# EAGLE schematic RasPiDV (EAGLE 6.4)
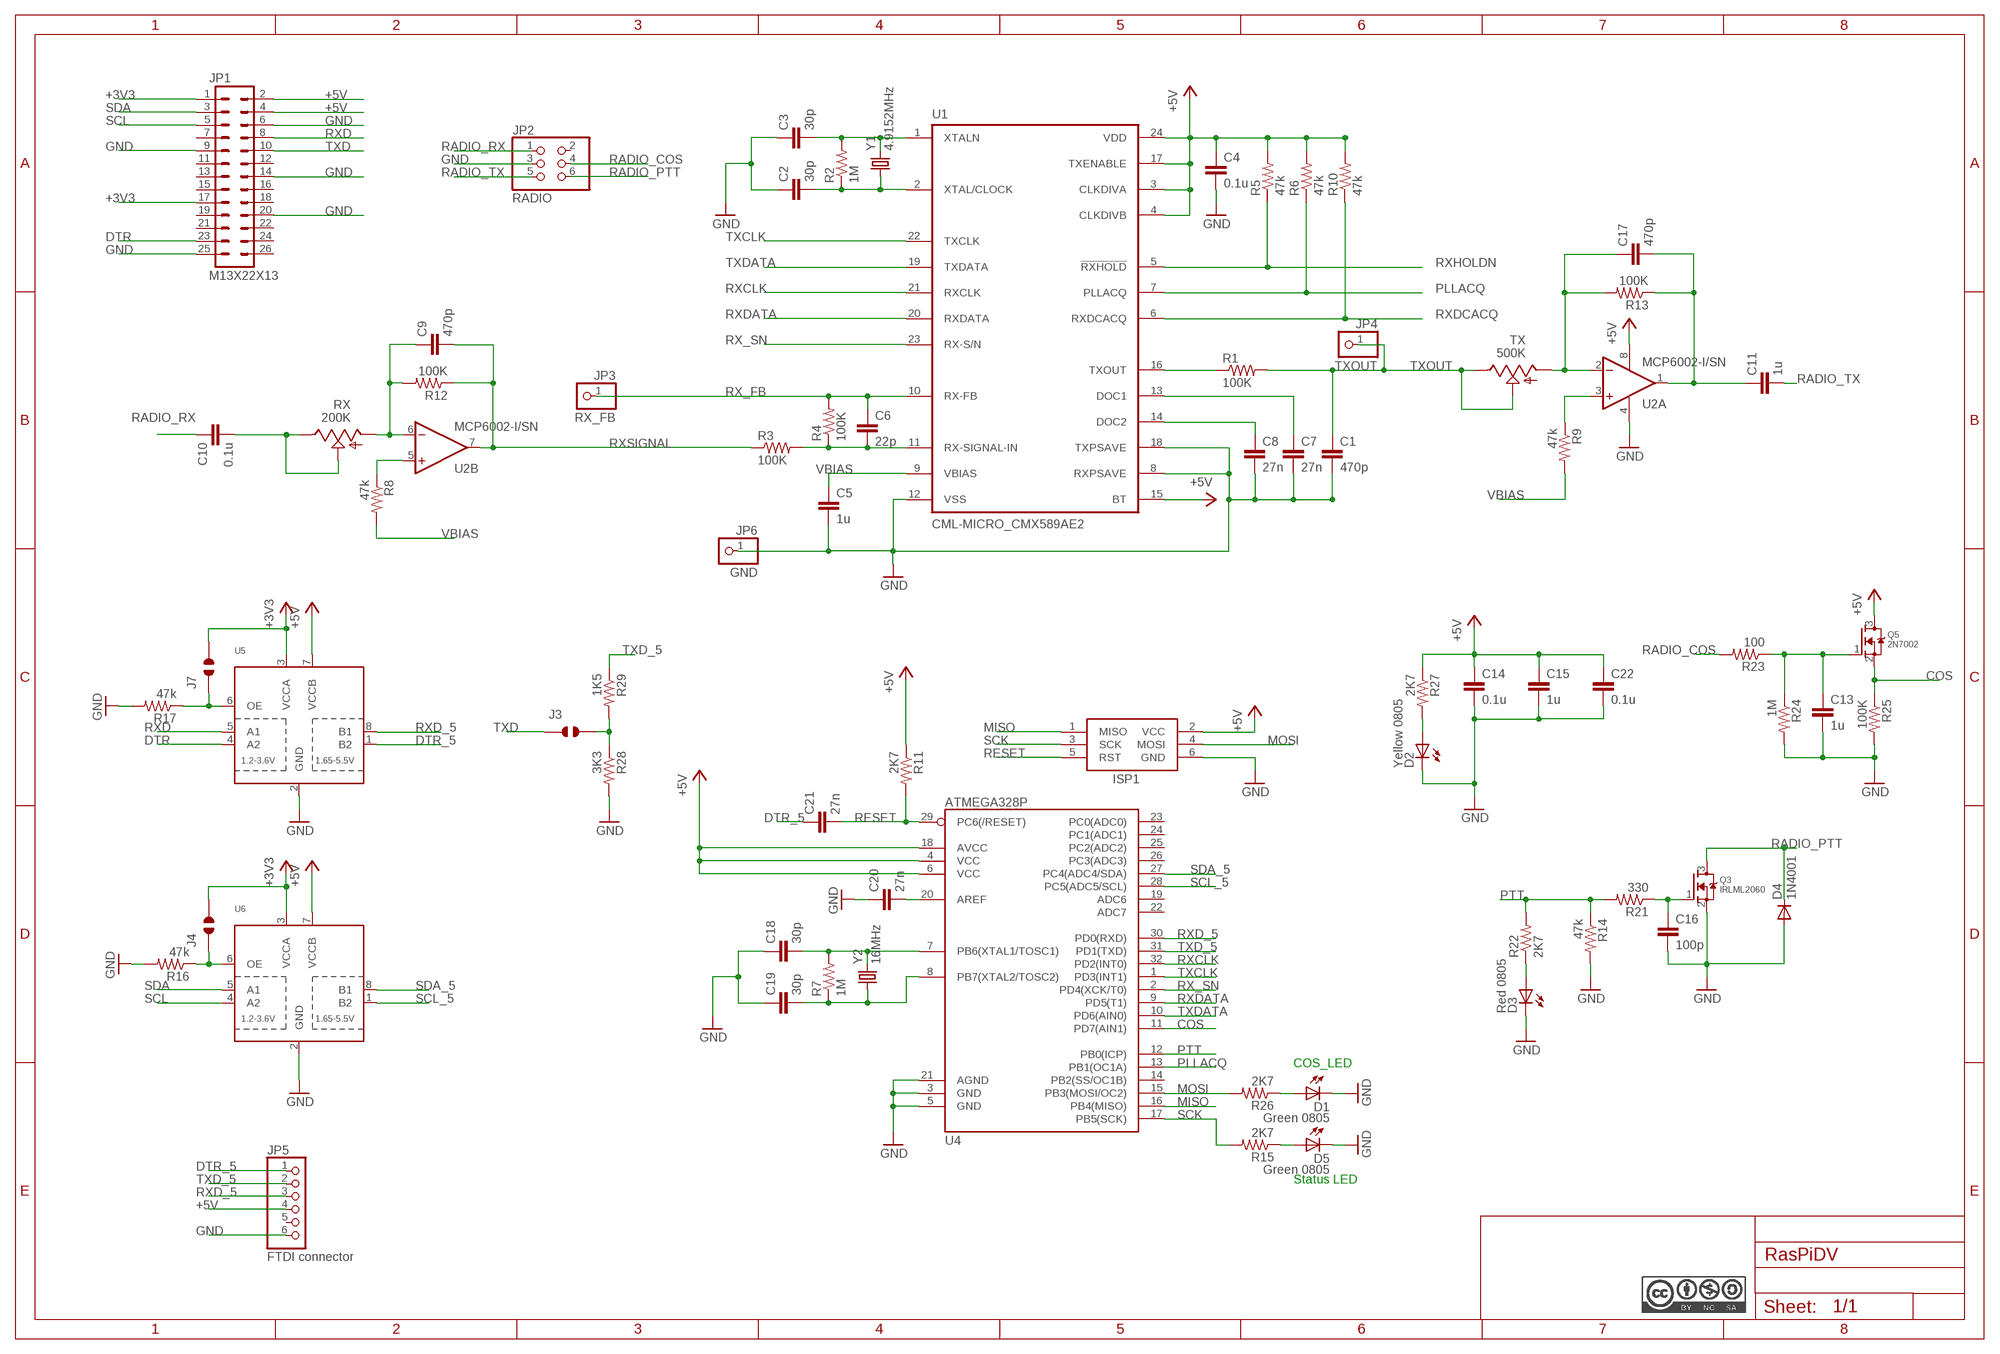
[diagram p0: schematic, sheet 1]

## Parts
C1  470p  C-EUC0805  [C0805]
C2  30p  C-EUC0805  [C0805]
C3  30p  C-EUC0805  [C0805]
C4  0.1u  C-EUC0805  [C0805]
C5  1u  C-EUC0805  [C0805]
C6  22p  C-EUC0805  [C0805]
C7  27n  C-EUC0805  [C0805]
C8  27n  C-EUC0805  [C0805]
C9  470p  C-EUC0805  [C0805]
C10  0.1u  C-EUC0805  [C0805]
C11  1u  C-EUC0805  [C0805]
C13  1u  C-EUC0805  [C0805]
C14  0.1u  C-EUC0805  [C0805]
C15  1u  C-EUC0805  [C0805]
C16  100p  C-EUC0805  [C0805]
C17  470p  C-EUC0805  [C0805]
C18  30p  C-EUC0805  [C0805]
C19  30p  C-EUC0805  [C0805]
C20  27n  C-EUC0805  [C0805]
C21  27n  C-EUC0805  [C0805]
C22  0.1u  C-EUC0805  [C0805]
D1  Green 0805  LEDCHIPLED_0805  [CHIPLED_0805]
D2  Yellow 0805  LEDCHIPLED_0805  [CHIPLED_0805]
D3  Red 0805  LEDCHIPLED_0805  [CHIPLED_0805]
D4  1N4001  DIODE-MICROMELF-R  [MICROMELF-R]
D5  Green 0805  LEDCHIPLED_0805  [CHIPLED_0805]
ISP1  AVRISP-6  [AVRISP]
J3  JUMPER_SOLDER_1X2  [JUMPER_SOLDER_1X2]
J4  JUMPER_SOLDER_1X2  [JUMPER_SOLDER_1X2]
J7  JUMPER_SOLDER_1X2  [JUMPER_SOLDER_1X2]
JP1  M13X22X13  [2X13]
JP2  RADIO  HEADER-2X3  [2X03_ROUND_70MIL]
JP3  RX_FB  HEADER-1X1ROUND  [1X01_ROUND]
JP4  TXOUT  HEADER-1X1ROUND  [1X01_ROUND]
JP5  FTDI connector  PINHD-1X6CLEAN  [1X06-CLEAN]
JP6  GND  HEADER-1X1ROUND  [1X01_ROUND]
Q3  IRLML2060  MOSFET-NREFLOW  [SOT23]
Q5  2N7002  MOSFET-NREFLOW  [SOT23-R]
R1  100K  R-US_M0805  [M0805]
R2  1M  R-US_M0805  [M0805]
R3  100K  R-US_M0805  [M0805]
R4  100K  R-US_M0805  [M0805]
R5  47k  R-US_M0805  [M0805]
R6  47k  R-US_M0805  [M0805]
R7  1M  R-US_M0805  [M0805]
R8  47k  R-US_M0805  [M0805]
R9  47k  R-US_M0805  [M0805]
R10  47k  R-US_M0805  [M0805]
R11  2K7  R-US_M0805  [M0805]
R12  100K  R-US_M0805  [M0805]
R13  100K  R-US_M0805  [M0805]
R14  47k  R-US_M0805  [M0805]
R15  2K7  R-US_M0805  [M0805]
R16  47k  R-US_M0805  [M0805]
R17  47k  R-US_M0805  [M0805]
R21  330  R-US_M0805  [M0805]
R22  2K7  R-US_M0805  [M0805]
R23  100  R-US_M0805  [M0805]
R24  1M  R-US_M0805  [M0805]
R25  100K  R-US_M0805  [M0805]
R26  2K7  R-US_M0805  [M0805]
R27  2K7  R-US_M0805  [M0805]
R28  3K3  R-US_M0805  [M0805]
R29  1K5  R-US_M0805  [M0805]
RX  200K  TRIM_US-B25P  [B25P]
TX  500K  TRIM_US-B25P  [B25P]
U1  CML-MICRO_CMX589AE2  AIS_MK2_CML-MICRO_CMX589AE2  [AIS_MK2_CML-MICRO_TSSOP24]
U2  MCP6002-I/SN  [SOIC-8]
U4  ATMEGA328P  ATMEGA328_SMT  [TQFP32-08]
U5  TXS0102DCTR  [SO08]
U6  TXS0102DCTR  [SO08]
Y1  4.9152MHz  CRYSTAL_CRYSTALHC49S  [CRYSTAL_HC49/S]
Y2  16MHz  CRYSTAL_CRYSTALHC49S  [CRYSTAL_HC49/S]

## Nets
+3V3 [pwr]: J4.2 J7.2 JP1.1 JP1.17 U5.3(VCCA) U6.3(VCCA)
+5V [pwr]: C4.1 C14.1 C15.1 C22.1 ISP1.2(VCC) JP1.2 JP1.4 JP5.4 Q5.3(D) R5.2 R6.2 R10.2 R11.1 R27.1 U1.3(CLKDIVA) U1.4(CLKDIVB) U1.15(BT) U1.17(TXENABLE) U1.24(VDD) U2.8(P:V+) U4.4(VCC) U4.6(VCC) U4.18(AVCC) U5.7(VCCB) U6.7(VCCB)
COS: Q5.2(S) R25.1 U4.11(PD7(AIN1))
DTR: JP1.23 U5.4(A2)
DTR_5: C21.1 JP5.1 U5.1(B2)
GND [pwr]: C1.2 C2.1 C3.1 C4.2 C5.2 C7.2 C8.2 C13.2 C14.2 C15.2 C16.2 C18.1 C19.1 C20.1 C22.2 D1.C D2.C D3.C D4.A D5.C ISP1.6(GND) JP1.6 JP1.9 JP1.14 JP1.20 JP1.25 JP2.3 JP5.6 JP6.1 Q3.2(S) R14.2 R16.2 R17.2 R24.2 R25.2 R28.2 U1.8(RXPSAVE) U1.12(VSS) U1.18(TXPSAVE) U2.4(P:V-) U4.3(GND) U4.5(GND) U4.21(AGND) U5.2(GND) U6.2(GND)
MISO: ISP1.1(MISO) U4.16(PB4(MISO))
MOSI: ISP1.4(MOSI) R26.2 U4.15(PB3(MOSI/OC2))
N$1: C13.1 Q5.1(G) R23.1 R24.1
N$2: D1.A R26.1
N$3: C10.2 RX.E RX.S
N$4: C8.1 U1.14(DOC2)
N$5: C7.1 U1.13(DOC1)
N$6: C6.2 R3.2 R4.1 U1.11(RX-SIGNAL-IN)
N$7: C9.1 R12.2 RX.A U2.6(B:IN-)
N$8: C19.2 R7.1 U4.8(PB7(XTAL2/TOSC2)) Y2.1
N$9: C2.2 R2.1 U1.2(XTAL/CLOCK) Y1.1
N$10: C3.2 R2.2 U1.1(XTALN) Y1.2
N$11: R8.1 U2.5(B:IN+)
N$12: R1.1 U1.16(TXOUT)
N$13: C18.2 R7.2 U4.7(PB6(XTAL1/TOSC1)) Y2.2
N$15: C11.1 C17.2 R13.1 U2.1(A:OUT)
N$16: D2.A R27.2
N$19: J3.2 R28.1 R29.2
N$20: R9.1 U2.3(A:IN+)
N$24: C16.1 Q3.1(G) R21.1
N$28: C17.1 R13.2 TX.A U2.2(A:IN-)
N$31: C20.2 U4.20(AREF)
N$32: D5.A R15.1
N$33: D3.A R22.1
N$35 [pwr]: J4.1 R16.1 U6.6(OE)
N$38 [pwr]: J7.1 R17.1 U5.6(OE)
PLLACQ: R6.1 U1.7(PLLACQ) U4.13(PB1(OC1A))
PTT: R14.1 R21.2 R22.2 U4.12(PB0(ICP))
RADIO_COS: JP2.4 R23.2
RADIO_PTT: D4.C JP2.6 Q3.3(D)
RADIO_RX: C10.1 JP2.1
RADIO_TX: C11.2 JP2.5
RESET: C21.2 ISP1.5(RST) R11.2 U4.29(PC6(/RESET))
RX_FB: C6.1 JP3.1 R4.2 U1.10(RX-FB)
RX_SN: U1.23(RX-S/N) U4.2(PD4(XCK/T0))
RXCLK: U1.21(RXCLK) U4.32(PD2(INT0))
RXD: JP1.8 U5.5(A1)
RXD_5: JP5.3 U4.30(PD0(RXD)) U5.8(B1)
RXDATA: U1.20(RXDATA) U4.9(PD5(T1))
RXDCACQ: R10.1 U1.6(RXDCACQ)
RXHOLDN: R5.1 U1.5(!RXHOLD!)
RXSIGNAL: C9.2 R3.1 R12.1 U2.7(B:OUT)
SCK: ISP1.3(SCK) R15.2 U4.17(PB5(SCK))
SCL: JP1.5 U6.4(A2)
SCL_5: U4.28(PC5(ADC5/SCL)) U6.1(B2)
SDA: JP1.3 U6.5(A1)
SDA_5: U4.27(PC4(ADC4/SDA)) U6.8(B1)
TXCLK: U1.22(TXCLK) U4.1(PD3(INT1))
TXD: J3.1 JP1.10
TXD_5: JP5.2 R29.1 U4.31(PD1(TXD))
TXDATA: U1.19(TXDATA) U4.10(PD6(AIN0))
TXOUT: C1.1 JP4.1 R1.2 TX.E TX.S
VBIAS: C5.1 R8.2 R9.2 U1.9(VBIAS)
Unconnected: JP1.7 JP1.11 JP1.12 JP1.13 JP1.15 JP1.16 JP1.18 JP1.19 JP1.21 JP1.22 JP1.24 JP1.26 JP2.2 JP5.5 U4.14(PB2(SS/OC1B)) U4.19(ADC6) U4.22(ADC7) U4.23(PC0(ADC0)) U4.24(PC1(ADC1)) U4.25(PC2(ADC2)) U4.26(PC3(ADC3))

## Notes on the sheet
- COS_LED
- Status LED

## Library data of the parts
C1-C11 C13-C22 = resistor:C-EU: CAPACITOR, European symbol
D1-D3 D5 = adafruit:LED: LED OSRAM: - CHIPLED LG R971, LG N971, LY N971, LG Q971, LY Q971, LO R971, LY R971 LH N974, LH R974 LS Q976, LO Q976, LY Q976 LO Q996 - Hyper CHIPLED LW Q18S LB Q993, LB Q99A, LB R99A - SideLED LS A670, LO A670, LY A670, LG A670, LP A670 LB A673, LV A673, LT A673, LW A673 LH A674 LY A675 LS A676, LA A676, LO A676, LY A676, LW A676 LS A679, LY A679, LG A679 - Hyper Micro SIDELED® LS Y876, LA Y876, LO Y876, LY Y876 LT Y87S - SmartLED LW L88C, LW L88S LB L89C, LB L89S, LG L890 LS L89K, LO L89K, LY L89K LS L896, LA L896, LO L896, LY L896 - TOPLED LS T670, LO T670, LY T670, LG T670, LP T670 LSG T670, LSP T670, LSY T670, LOP T670, LYG T670 LG T671, LOG T671, LSG T671 LB T673, LV T673, LT T673, LW T673 LH T674 LS T676, LA T676, LO T676, LY T676, LB T676, LH T676, LSB T676, LW T676 LB T67C, LV T67C, LT T67C, LS T67K, LO T67K, LY T67K, LW E67C LS E67B, LA E67B, LO E67B, LY E67B, LB E67C, LV E67C, LT E67C LW T67C LS T679, LY T679, LG T679 LS T770, LO T770, LY T770, LG T770, LP T770 LB T773, LV T773, LT T773, LW T773 LH T774 LS E675, LA E675, LY E675, LS T675 LS T776, LA T776, LO T776, LY T776, LB T776 LHGB T686 LT T68C, LB T68C - Hyper Mini TOPLED® LB M676 - Mini TOPLED Santana® LG M470 LS M47K, LO M47K, LY M47K Source: http://www.osram.convergy.de/
D4 = diode:DIODE-: DIODE
ISP1 = adafruit:AVRISP: AVR ISP HEADER Standard 6 pin header for AVR programming
J3 J4 J7 = dp_devices:JUMPER_SOLDER_1X2
JP1 = SparkFun-Connectors:M13X2: 0.1" spaced headers
JP2 = microbuilder:HEADER-2X3: PIN HEADER
JP3 JP4 JP6 = microbuilder:HEADER-1X1: PIN HEADER
JP5 = adafruit:PINHD-1X6: PIN HEADER
Q3 = adafruit:MOSFET-N: N-Channel Mosfet 2N7002E - 60V 260mA SOT23 [Digikey: 2N7002ET1GOSTR-ND] - REEL BSH103 - 30V 850mA SOT23 [Digikey: 568-5013-1-ND]
Q5 = microbuilder:MOSFET-N: N-Channel Mosfet LEGEND VDS: Voltage Drain-Source ID: Drain Current RDS(ON): Drain-Source On-State Resistance VGS(TH): Gate-Source Threshold Voltage CISS: Drain-Source Input Capacitance SOT-23 Name VDS ID RDS(ON) VGS(TH) CISS Order Number 2N7002E 60V 260mA 2.5 Ohm 2.5V @ 250uA 26.7pF @ 25V 2N7002ET1GOSTR-ND BSH103 30V 850mA 400 mOhm 400mV @ 1mA 83pF @ 24V BSH103,235-ND BSS138 60V 320mA 1.6 Ohm 1.5V @ 250uA 50pF @ 10V Mouser: 771-BSS138PW115 DMN2075U-7 20V 4.2A 38 mOhm 1V @ 250 uA 594.3pF @ 10V DMN2075U-7DICT-ND * BSS138 good choice for I2C level-shifting
R1-R17 R21-R29 = adafruit:R-US_: RESISTOR, American symbol
RX TX = pot:TRIM_US-: POTENTIOMETER
U1 = mylibrary:AIS_MK2_CML-MICRO_CMX589A: HIGH-SPEED GMSK MODEM
U2 = linear-mcp-600x:MCP6002: Dual Op Amp 1.8V to 5.5V Single Supply CMOS Source: http://ww1.microchip.com/downloads/en/DeviceDoc/21733h.pdf.
U4 = SparkFun-DigitalIC:ATMEGA328_SMT: 32-Pin Atmega328 part Commonly used on Arduino compatible boards Available in QFP and QFN packages TQFP is IC-09069 QFN is non-stock; PROD_ID: IC-09069
U5 U6 = mylibrary:TXS0102: 2-Bit Bi-Directional Level Shifter (I2C, etc.) Designed for I2C devices and has internal pullups. Not to be confused with TXB010x series. 1.2V-3.6V (VCCA) to 1.65V-5.5V (VCCB) bi-directional level shifter with auto direction sensing. Max data rate - 24Mbps (Push Pull), 2Mbps (Open Drain) Digikey: 296-21931-1-ND
Y1 Y2 = AIS_Mk2:CRYSTAL_CRYSTAL: CRYSTAL

## Net classes
1 pwr: width 0.381 mm